# Altium project STM32F030.PrjPcb
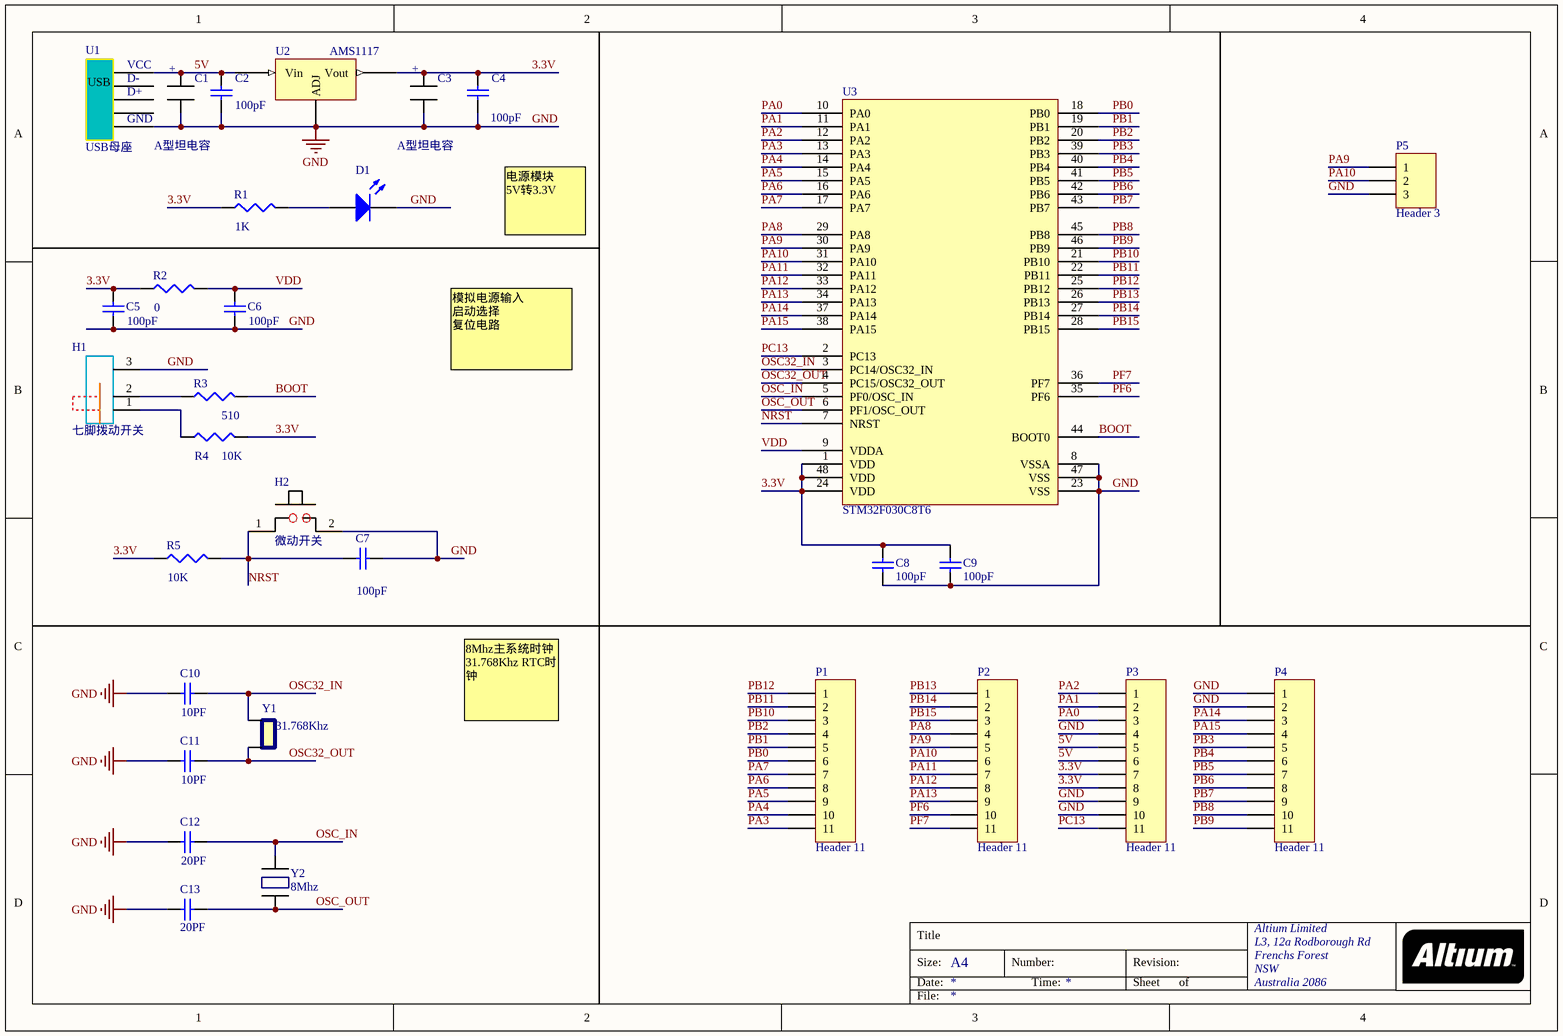
[diagram p0: STM32F030.SchDoc]
1 sheet, 31 parts. Net scope: global (net labels, ports and power ports of the same name join across sheets).
Board file: STM32F030.PcbDoc

## Sheet STM32F030.SchDoc
size A4; Organization: Altium Limited; Address1: L3, 12a Rodborough Rd; Address2: Frenchs Forest; Address3: NSW; Address4: Australia 2086

### Parts
C1  A型坦电容  [A型坦电容]
C2  value 100pF  [C1206]  (hidden comment: 0.1UF)
C3  A型坦电容  [A型坦电容]
C4  value 100pF  [C1206]  (hidden comment: 0.1UF)
C5  value 100pF  [C1206]  (hidden comment: 0.1UF)
C6  value 100pF  [C1206]  (hidden comment: 0.1UF)
C7  value 100pF  [C1206]  (hidden comment: 0.1UF)
C8  value 100pF  [C1206]  (hidden comment: 0.1UF)
C9  value 100pF  [C1206]  (hidden comment: 0.1UF)
C10  10PF  [C1206]
C11  10PF  [C1206]
C12  20PF  [C1206]
C13  20PF  [C1206]
D1  LED  [3.2X1.6X1.1]  (value not drawn)
H1  七脚拨动开关  [七脚拨动开磁]
H2  微动开关  [微动开关]
P1  Header 11  [HDR1X11]
P2  Header 11  [HDR1X11]
P3  Header 11  [HDR1X11]
P4  Header 11  [HDR1X11]
P5  Header 3  [HDR1X3]
R1  1K  [14-1210]
R2  0  [14-1210]
R3  510  [14-1210]
R4  10K  [14-1210]
R5  10K  [14-1210]
U1  USB母座  [MicroUSB母座]
U2  AMS1117  [AMS1117]
U3  STM32F030C8T6  [STM32F030C8T6]
Y1  31.768Khz  [31.768khz(3*8)]
Y2  8Mhz  [晶振]

### Nets
GND: C1.1 C2.1 C3.1 C4.1 C5.1 C6.1 C7.2 C8.1 C9.1 C10.1 C11.1 C12.1 C13.1 D1.2(K) H1.3 H2.2 P3.4 P3.9 P3.10 P4.1 P4.2 P5.3 U1.5 U2.1(ADJ) U3.8(VSSA) U3.23(VSS) U3.47(VSS)
3.3V: C3.2(+) C4.2 C5.2 C8.2 C9.2 P3.7 P3.8 R1.1 R2.1 R4.2 R5.1 U2.2(Vout) U3.1(VDD) U3.24(VDD) U3.48(VDD)
5V: C1.2(+) C2.2 P3.5 P3.6 U1.1 U2.3(Vin)
BOOT: R3.2 U3.44(BOOT0)
NRST: C7.1 H2.1 R5.2 U3.7(NRST)
OSC32_IN: C10.2 U3.3(PC14/OSC32_IN) Y1.0
OSC32_OUT: C11.2 U3.4(PC15/OSC32_OUT) Y1.1
OSC_IN: C12.2 U3.5(PF0/OSC_IN) Y2.2
OSC_OUT: C13.2 U3.6(PF1/OSC_OUT) Y2.1
PA0: P3.3 U3.10(PA0)
PA1: P3.2 U3.11(PA1)
PA2: P3.1 U3.12(PA2)
PA3: P1.11 U3.13(PA3)
PA4: P1.10 U3.14(PA4)
PA5: P1.9 U3.15(PA5)
PA6: P1.8 U3.16(PA6)
PA7: P1.7 U3.17(PA7)
PA8: P2.4 U3.29(PA8)
PA9: P2.5 P5.1 U3.30(PA9)
PA10: P2.6 P5.2 U3.31(PA10)
PA11: P2.7 U3.32(PA11)
PA12: P2.8 U3.33(PA12)
PA13: P2.9 U3.34(PA13)
PA14: P4.3 U3.37(PA14)
PA15: P4.4 U3.38(PA15)
PB0: P1.6 U3.18(PB0)
PB1: P1.5 U3.19(PB1)
PB2: P1.4 U3.20(PB2)
PB3: P4.5 U3.39(PB3)
PB4: P4.6 U3.40(PB4)
PB5: P4.7 U3.41(PB5)
PB6: P4.8 U3.42(PB6)
PB7: P4.9 U3.43(PB7)
PB8: P4.10 U3.45(PB8)
PB9: P4.11 U3.46(PB9)
PB10: P1.3 U3.21(PB10)
PB11: P1.2 U3.22(PB11)
PB12: P1.1 U3.25(PB12)
PB13: P2.1 U3.26(PB13)
PB14: P2.2 U3.27(PB14)
PB15: P2.3 U3.28(PB15)
PC13: P3.11 U3.2(PC13)
PF6: P2.10 U3.35(PF6)
PF7: P2.11 U3.36(PF7)
VDD: C6.2 R2.2 U3.9(VDDA)
NetD1_1: D1.1(A) R1.2
NetH1_1: H1.1 R4.1
NetH1_2: H1.2 R3.1

Not connected (* = marked no-connect by the designer): U1 2 3 4

### Notes on the sheet
- 电源模块
  5V转3.3V
- 模拟电源输入
  启动选择
  复位电路
- 8Mhz主系统时钟
  31.768Khz RTC时钟
- Title
- Size:
- Date:
- A4
- Number:
- Time:
- Revision:
- Sheet
- of
- File:
- (in symbol MicroUSB母座) VCC; D-; D+; GND; / USB /

### Library data of the parts
C1 C3 = A型坦电容: C?; pin to pad: 1>0 2>1
C2 C4-C13 = Cap Semi: Capacitor (Semiconductor SIM Model); Published: 8-Jun-2000; LatestRevisionDate: 29-May-2009; LatestRevisionNote: IPC-7351 Footprint Added.; PackageReference: C1206; Publisher: Altium Limited; PackageDescription: Chip Capacitor
  C10 C11: Value: 10PF
  C12 C13: Value: 20PF
D1 = LED2: Typical RED, GREEN, YELLOW, AMBER GaAs LED; Published: 8-Jun-2000; LatestRevisionDate: 17-Jul-2002; LatestRevisionNote: Re-released for DXP Platform.; PackageVersion: Feb-2002; PackageReference: 3.2X1.6X1.1; Publisher: Altium Limited; PackageDescription: SM LED; 2 Flat Leads
H1 = 七脚拨动开关: H?
H2 = 微动开关: H?
P1-P4 = Header 11: Header, 11-Pin; LatestRevisionDate: 17-Jul-2002; LatestRevisionNote: Re-released for DXP Platform.; Publisher: Altium Limited
P5 = Header 3: Header, 3-Pin; LatestRevisionDate: 17-Jul-2002; LatestRevisionNote: Re-released for DXP Platform.; Publisher: Altium Limited
R1-R5 = Res3: Resistor; Published: 8-Jun-2000; LatestRevisionDate: 29-May-2009; LatestRevisionNote: IPC-7351 Footprint Added.; PackageReference: J1-0603; Publisher: Altium Limited; PackageDescription: Chip Resistor
  R1: Value: 1K
  R2: Value: 0
  R3: Value: 510
  R4 R5: Value: 10K
U1 = MicroUSB母座: U?
U2 = AMS1117: U?
U3 = STM32F030C8T6: U?
Y1 = 31.768khz(3*8): Y?
Y2 = 晶振: Y?